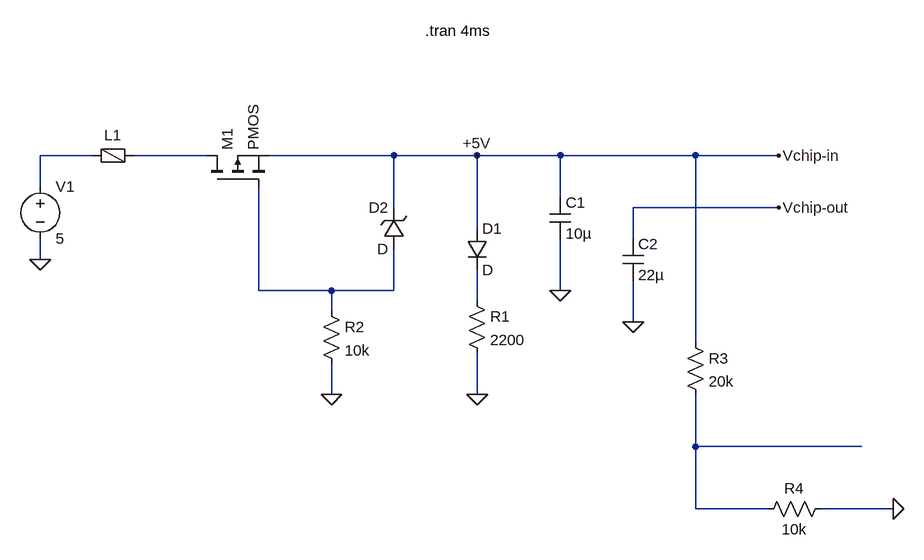
[diagram p0: schematic Voltage Converter.asc]
Voltage Converter.asc, the LTspice schematic file:
Version 4
SHEET 1 1436 872
WIRE 112 288 32 288
WIRE 288 288 176 288
WIRE 576 288 384 288
WIRE 704 288 576 288
WIRE 832 288 704 288
WIRE 1040 288 832 288
WIRE 1168 288 1040 288
WIRE 32 336 32 288
WIRE 832 352 832 288
WIRE 576 368 576 288
WIRE 1168 368 944 368
WIRE 704 400 704 288
WIRE 944 416 944 368
WIRE 32 448 32 416
WIRE 368 496 368 336
WIRE 480 496 368 496
WIRE 576 496 576 432
WIRE 576 496 480 496
WIRE 832 496 832 416
WIRE 704 512 704 464
WIRE 480 528 480 496
WIRE 944 544 944 480
WIRE 1040 576 1040 288
WIRE 480 656 480 608
WIRE 704 656 704 592
WIRE 1040 736 1040 656
WIRE 1296 736 1040 736
WIRE 1040 832 1040 736
WIRE 1152 832 1040 832
WIRE 1344 832 1232 832
FLAG 704 656 0
FLAG 480 656 0
FLAG 832 496 0
FLAG 32 448 0
FLAG 704 288 +5V
FLAG 1168 288 Vchip-in
FLAG 1168 368 Vchip-out
FLAG 944 544 0
FLAG 1344 832 0
SYMBOL pmos 288 336 R270
SYMATTR InstName M1
SYMBOL diode 688 400 R0
SYMATTR InstName D1
SYMBOL res 688 496 R0
SYMATTR InstName R1
SYMATTR Value 2200
SYMBOL res 464 512 R0
SYMATTR InstName R2
SYMATTR Value 10k
SYMBOL cap 816 352 R0
SYMATTR InstName C1
SYMATTR Value 10µ
SYMBOL FerriteBead 144 288 R90
WINDOW 0 -16 0 VBottom 2
SYMATTR InstName L1
SYMATTR SpiceLine Rser=100
SYMBOL voltage 32 320 R0
SYMATTR InstName V1
SYMATTR Value 5
SYMBOL zener 592 432 R180
WINDOW 0 24 64 Left 2
WINDOW 3 24 0 Left 2
SYMATTR InstName D2
SYMBOL cap 928 416 R0
SYMATTR InstName C2
SYMATTR Value 22µ
SYMBOL res 1024 560 R0
SYMATTR InstName R3
SYMATTR Value 20k
SYMBOL res 1248 816 R90
WINDOW 0 0 56 VBottom 2
WINDOW 3 32 56 VTop 2
SYMATTR InstName R4
SYMATTR Value 10k
TEXT 624 96 Left 2 !.tran 4ms

The netlist it stands for:
* Voltage Converter.asc
M1 N002 N003 Vchip-in Vchip-in PMOS
D1 Vchip-in N004 D
R1 N004 0 2200
R2 N003 0 10k
C1 Vchip-in 0 10µ
L1 N002 N001 Rser=100
V1 N001 0 5
D2 N003 Vchip-in D
C2 Vchip-out 0 22µ
R3 Vchip-in N005 20k
R4 0 N005 10k
.model D D
.lib standard.dio
.model NMOS NMOS
.model PMOS PMOS
.lib standard.mos
.tran 4ms
.backanno
.end